# Altium schematic sheet 4G.SchDoc
size A2
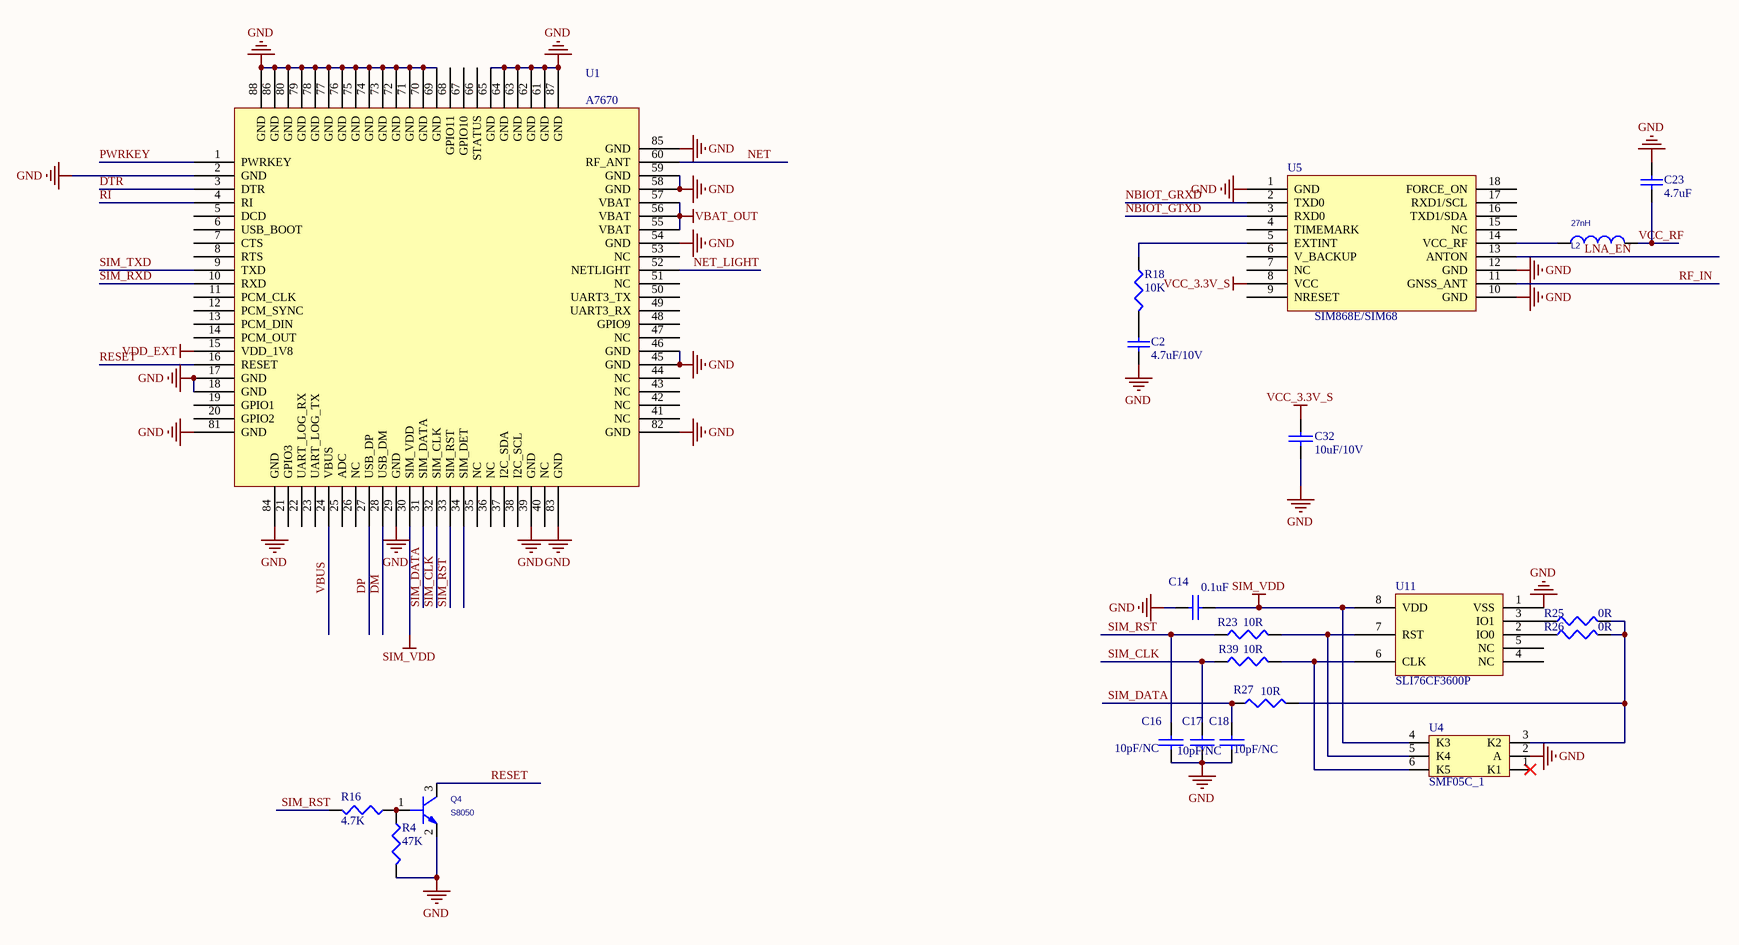
[diagram p0: 4G.SchDoc]

## Parts
C2  4.7uF/10V  [0402c]
C14  0.1uF  [0402C]
C16  10pF/NC  [0402C]
C17  10pF/NC  [0402C]
C18  10pF/NC  [0402C]
C23  4.7uF  [0402c]
C32  10uF/10V  [0402C]
L2  27nH  [0402R]
Q4  S8050  [SOT23]
R4  47K  [0402R]
R16  4.7K  [0402R]
R18  10K  [0402R]
R23  10R  [0402R]
R25  0R  [0402R]
R26  0R  [0402R]
R27  10R  [0402R]
R39  10R  [0402R]
U1  A7670  [A7670]
U4  SMF05C_1  [SC70-6L]
U5  SIM868E/SIM68  [SIM68MB]
U11  SLI76CF3600P  [QFN127P500X600X80-8N]

## Nets
GND: C2.1 C14.1 C16.1 C17.1 C18.1 C23.1 C32.1 Q4.2(E) R4.2 U1.2(GND) U1.17(GND) U1.18(GND) U1.29(GND) U1.39(GND) U1.45(GND) U1.46(GND) U1.54(GND) U1.58(GND) U1.59(GND) U1.61(GND) U1.62(GND) U1.63(GND) U1.64(GND) U1.65(GND) U1.69(GND) U1.70(GND) U1.71(GND) U1.72(GND) U1.73(GND) U1.74(GND) U1.75(GND) U1.76(GND) U1.77(GND) U1.78(GND) U1.79(GND) U1.80(GND) U1.81(GND) U1.82(GND) U1.83(GND) U1.84(GND) U1.85(GND) U1.86(GND) U1.87(GND) U1.88(GND) U4.2(A) U5.1(GND) U5.10(GND) U5.12(GND) U11.1(VSS)
SIM_VDD: C14.2 U1.30(SIM_VDD) U4.4(K3) U11.8(VDD)
VBAT_OUT: U1.55(VBAT) U1.56(VBAT) U1.57(VBAT)
VCC_3.3V_S: C32.2 U5.8(VCC)
VDD_EXT: U1.15(VDD_1V8)
DM: U1.28(USB_DM)
DP: U1.27(USB_DP)
DTR: U1.3(DTR)
LNA_EN: U5.13(ANTON)
NBIOT_GRXD: U5.2(TXD0)
NBIOT_GTXD: U5.3(RXD0)
NET: U1.60(RF_ANT)
NET_LIGHT: U1.52(NETLIGHT)
PWRKEY: U1.1(PWRKEY)
RESET: Q4.3(C) U1.16(RESET)
RF_IN: U5.11(GNSS_ANT)
RI: U1.4(RI)
SIM_CLK: C17.2 R39.1 U1.32(SIM_CLK)
SIM_DATA: C18.2 R27.1 U1.31(SIM_DATA)
SIM_RST: C16.2 R16.2 R23.1 U1.33(SIM_RST)
SIM_RXD: U1.10(RXD)
SIM_TXD: U1.9(TXD)
VBUS: U1.24(VBUS)
VCC_RF: C23.2 L2.2
NetC2_2: C2.2 R18.2
NetL2_1: L2.1 U5.14(VCC_RF)
NetQ4_1: Q4.1(B) R4.1 R16.1
NetR18_1: R18.1 U5.5(EXTINT)
NetR23_2: R23.2 U4.5(K4) U11.7(RST)
NetR25_1: R25.1 U11.3(IO1)
NetR25_2: R25.2 R26.2 R27.2 U4.3(K2)
NetR26_1: R26.1 U11.2(IO0)
NetR39_2: R39.2 U4.6(K5) U11.6(CLK)

Not connected (* = marked no-connect by the designer): U1 5(DCD) 6(USB_BOOT) 7(CTS) 8(RTS) 11(PCM_CLK) 12(PCM_SYNC) 13(PCM_DIN) 14(PCM_OUT) 19(GPIO1) 20(GPIO2) 21(GPIO3) 22(UART_LOG_RX) 23(UART_LOG_TX) 25(ADC) 26(NC) 34(SIM_DET) 35(NC) 36(NC) 37(I2C_SDA) 38(I2C_SCL) 40(NC) 41(NC) 42(NC) 43(NC) 44(NC) 47(NC) 48(GPIO9) 49(UART3_RX) 50(UART3_TX) 51(NC) 53(NC) 66(STATUS) 67(GPIO10) 68(GPIO11); U4 1(K1)*; U5 4(TIMEMARK) 6(V_BACKUP) 7(NC) 9(NRESET) 15(NC) 16(TXD1/SDA) 17(RXD1/SCL) 18(FORCE_ON); U11 4(NC) 5(NC)

## Library data of the parts
C2 C23 = Cap: Capacitor; Value: 0.1uF/10V; Published: 8-Jun-2000; LatestRevisionDate: 17-Jul-2002; LatestRevisionNote: Re-released for DXP Platform.; PackageReference: RAD-0.3; Publisher: Altium Limited
C14 C16-C18 C32 = CAP: Capacitor
L2 = INDUCTOR_1
Q4 = 2N1069_1: PspiceTemplate: Q^@REFDES %C %B %E
R4 R16 R18 R23 R25-R27 R39 = RES1: P: 1/8W
U4 = SMF05C_1: TVS
U5 = SIM68MB